# Altium project ComboCamera_MT9.PrjPcb (part 1 of 2)
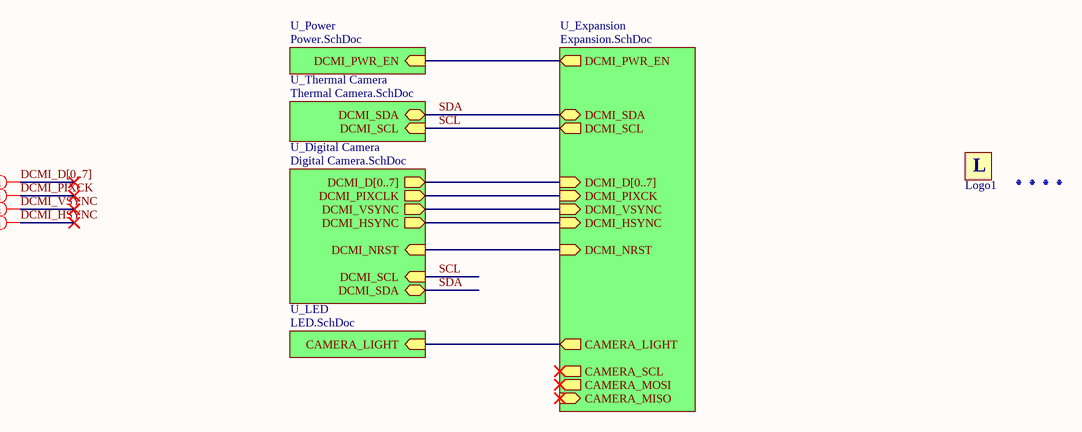
[diagram p0: ComboCamera_MT9.SchDoc]
6 sheets, 82 parts. Net scope: hierarchical (ports join the sheet entries above them; power ports are global).
Board file: ComboCamera_MT9.PcbDoc
Sheets:
  ComboCamera_MT9.SchDoc
    U_Power = Power.SchDoc
    U_Digital Camera = Digital Camera.SchDoc
    U_Thermal Camera = Thermal Camera.SchDoc
    U_Expansion = Expansion.SchDoc
    U_LED = LED.SchDoc

## Sheet ComboCamera_MT9.SchDoc: Combo Camera
size A4; Revision: 1; SheetNumber: 1; SheetTotal: 1; SheetSize: A4

### Parts
Fid1  Fiducial mark  [Fiducial]  (value not drawn)  (no BOM)
Fid2  Fiducial mark  [Fiducial]  (value not drawn)  (no BOM)
Fid3  Fiducial mark  [Fiducial]  (value not drawn)  (no BOM)
Fid4  Fiducial mark  [Fiducial]  (value not drawn)  (no BOM)
Logo1  Logo symbol  [LOGO_YILDIZIOT]  (value not drawn)  (no BOM)

### Sub-sheets
U_Digital Camera = Digital Camera.SchDoc: DCMI_D[0..7] (out), DCMI_PIXCLK (out), DCMI_VSYNC (out), DCMI_HSYNC (out), DCMI_SCL (in), DCMI_SDA (bidir), DCMI_NRST (in)
U_Expansion = Expansion.SchDoc: DCMI_NRST (in), DCMI_D[0..7] (in), DCMI_PWR_EN (out), DCMI_VSYNC (in), DCMI_HSYNC (in), DCMI_PIXCK (in), DCMI_SDA (bidir), DCMI_SCL (out), CAMERA_SCL (out), CAMERA_MISO (in), CAMERA_MOSI (out), CAMERA_LIGHT (out)
U_LED = LED.SchDoc: CAMERA_LIGHT (in)
U_Power = Power.SchDoc: DCMI_PWR_EN (in)
U_Thermal Camera = Thermal Camera.SchDoc: DCMI_SDA (bidir), DCMI_SCL (in)

### Nets
CAMERA_LIGHT: sheet U_Expansion/CAMERA_LIGHT, sheet U_LED/CAMERA_LIGHT
DCMI_HSYNC: sheet U_Digital Camera/DCMI_HSYNC, sheet U_Expansion/DCMI_HSYNC
DCMI_NRST: sheet U_Digital Camera/DCMI_NRST, sheet U_Expansion/DCMI_NRST
DCMI_PIXCK: sheet U_Digital Camera/DCMI_PIXCLK, sheet U_Expansion/DCMI_PIXCK
DCMI_PWREN: sheet U_Power/DCMI_PWR_EN, sheet U_Expansion/DCMI_PWR_EN
DCMI_VSYNC: sheet U_Digital Camera/DCMI_VSYNC, sheet U_Expansion/DCMI_VSYNC
SCL: sheet U_Digital Camera/DCMI_SCL, sheet U_Thermal Camera/DCMI_SCL, sheet U_Expansion/DCMI_SCL  [project net DCMI_SCL]
SDA: sheet U_Digital Camera/DCMI_SDA, sheet U_Thermal Camera/DCMI_SDA, sheet U_Expansion/DCMI_SDA  [project net DCMI_SDA]

### Buses and harness runs
bus DCMI_D[0..7]
bus sheet U_Digital Camera/DCMI_D[0..7] = sheet U_Expansion/DCMI_D[0..7]

### Layout directives
rule Matched Net Lengths [Tolerance = 100mil]; net class DCMI: (no net found under the mark), DCMI_HSYNC, DCMI_PIXCK, DCMI_VSYNC

### Notes on the sheet
- Title:
- Size:
- Project:
- Revision:
- Sheet
- of
- Date:
- YıLDıZ IoT
- Elperek Mahallesi
- Saray Sokak, No:12
- SAKARYA / TURKEY
- File:
- (in symbol Logo) L

### Library data of the parts
Fid1-Fid4 = Fiducial: Part Number: Fid-Mark; Artikkelnr Noca: N.A.; Manufacturer: *; Manufacturer Part Number: *; Datasheet: *; LatestRevisionDate: 2009-12-12; Pin Count: 1; Publisher: Nordic Semiconductor; Published: 2009-12-12; Value: *; Note: *; Supplier: *; Supplier part number: *; 2nd source Supplier: *; 2nd source part number: *; Footprint Doc: Fiducial; Artikkelnr Simpro: N.A.
Logo1 = Logo: Schematic symbol for Logo

## Sheet Power.SchDoc: POWER
size A4; SheetSize: A4
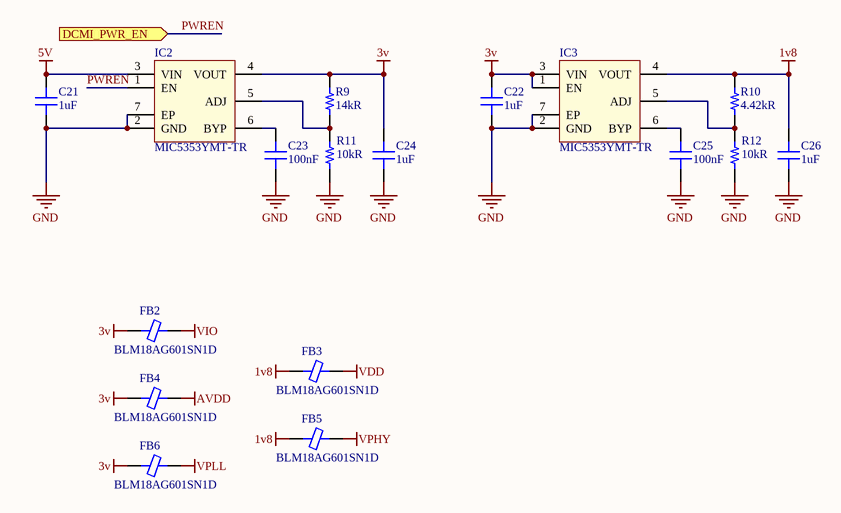
[diagram p1: Power.SchDoc]

### Parts
C21  1uF  [CAP 0603/1608]
C22  1uF  [CAP 0603/1608]
C23  100nF  [CAP 0603/1608]
C24  1uF  [CAP 0603/1608]
C25  100nF  [CAP 0603/1608]
C26  1uF  [CAP 0603/1608]
FB2  BLM18AG601SN1D  [FER 0603/1608]
FB3  BLM18AG601SN1D  [FER 0603/1608]
FB4  BLM18AG601SN1D  [FER 0603/1608]
FB5  BLM18AG601SN1D  [FER 0603/1608]
FB6  BLM18AG601SN1D  [FER 0603/1608]
IC2  MIC5353YMT-TR  [MICREL MLF-6 1.6x1.6MM]
IC3  MIC5353YMT-TR  [MICREL MLF-6 1.6x1.6MM]
R9  14kR  [RES 0603/1608]
R10  4.42kR  [RES 0603/1608]
R11  10kR  [RES 0603/1608]
R12  10kR  [RES 0603/1608]

### Ports
DCMI_PWR_EN (in)

### Nets
1v8: C26.2 FB3.2 FB5.2 IC3.4(VOUT) R10.2
3v: C22.2 C24.2 FB2.2 FB4.2 FB6.2 IC2.4(VOUT) IC3.1(EN) IC3.3(VIN) R9.2
5V: C21.2 IC2.3(VIN)
AVDD: FB4.1
GND: C21.1 C22.1 C23.1 C24.1 C25.1 C26.1 IC2.2(GND) IC2.7(EP) IC3.2(GND) IC3.7(EP) R11.2 R12.2
VDD: FB3.1
VIO: FB2.1
VPHY: FB5.1
VPLL: FB6.1
PWREN: IC2.1(EN) ; port DCMI_PWR_EN  [project net DCMI_PWREN]
NetC23_2: C23.2 IC2.6(BYP)
NetC25_2: C25.2 IC3.6(BYP)
NetIC2_5: IC2.5(ADJ) R9.1 R11.1
NetIC3_5: IC3.5(ADJ) R10.1 R12.1

### Notes on the sheet
- Title:
- Size:
- Project:
- Revision:
- Sheet
- of
- Date:
- YıLDıZ IoT
- Elperek Mahallesi
- Saray Sokak, No:12
- SAKARYA / TURKEY
- File:

### Library data of the parts
C21 C22 C24 C26 = Capacitor - Ceramic: Ceramic, SMT Capacitor; Manufacturer: Samsung; Manufacturer Part Number: CL10A105KP8NNNC; Tolerance: 10%; Voltage Rating: 10V; Dielectric: X5R; Supplier 1: Digi-Key; Supplier Part Number 1: 1276-1182-1-ND; Stock 1: 4590831; Pricing 1: 1 = 0,10000, 10 = 0,03800, 100 = 0,01680, 500 = 0,01200, 1000 = 0,00943 (USD); RoHS: Yes; Mount: Surface Mount; Case/Package: 0603; Case Code (Metric): 1608; Case Code (Imperial): 0603; Contact Plating: Tin; Min Operating Temperature: -55°C; Max Operating Temperature: 85°C; Packaging: Tape and Reel; Package Quantity: 1; Capacitance: 1uF; Voltage: 10V; Length: 1.6mm; Height: 0.8mm; Width: 0.031inch; Thickness: 0.035inch; Depth: 0.8mm; Radiation Hardening: No; ComponentLink1URL: https://datasheet.ciiva.com/15195/getdatasheetpartid-358616-15195708.pdf?src-supplier=Verical; ComponentLink1Description: https://datasheet.ciiva.com/15195/getdatasheetpartid-358616-15195708.pdf?src-supplier=Verical; ComponentLink2URL: https://datasheet.ciiva.com/16358/cl05b104kq5nnnc-16358431.pdf?src-supplier=Future+Electronics; ComponentLink2Description: https://datasheet.ciiva.com/16358/cl05b104kq5nnnc-16358431.pdf?src-supplier=Future+Electronics
C23 C25 = Capacitor - Ceramic: Ceramic, SMT Capacitor; Manufacturer: Samsung; Manufacturer Part Number: CL10B104JB8NNNC; Tolerance: 5%; Voltage Rating: 50V; Dielectric: X7R; Supplier 1: Digi-Key; Supplier Part Number 1: 1276-1033-1-ND; Stock 1: 223594; Pricing 1: 1 = 0,10000, 10 = 0,05300, 100 = 0,02350, 500 = 0,01680, 1000 = 0,01320 (USD); RoHS: Yes; Mount: Surface Mount; Case/Package: 0603; Case Code (Metric): 1608; Case Code (Imperial): 0603; Material: Ceramic; Contact Plating: Tin; Min Operating Temperature: -55°C; Max Operating Temperature: 125°C; Packaging: Tape and Reel; Package Quantity: 1; Capacitance: 100nF; Voltage: 50V; Length: 1.6mm; Height: 0.8mm; Width: 0.031inch; Thickness: 0.035inch; Depth: 0.8mm; Radiation Hardening: No; ComponentLink1URL: https://media.digikey.com/pdf/Data%20Sheets/Samsung%20PDFs/CL_Series_MLCC_ds.pdf?src-supplier=Digi-Key; ComponentLink1Description: https://media.digikey.com/pdf/Data%20Sheets/Samsung%20PDFs/CL_Series_MLCC_ds.pdf?src-supplier=Digi-Key; ComponentLink2URL: https://www.verical.com/server-webapp/html/getDatasheet?partID=359321&src-supplier=Verical; ComponentLink2Description: https://www.verical.com/server-webapp/html/getDatasheet?partID=359321&src-supplier=Verical; ComponentLink3URL: http://www1.futureelectronics.com/doc/SAMSUNG/CL10B104JB8NNNC.pdf?src-supplier=Future+Electronics; ComponentLink3Description: http://www1.futureelectronics.com/doc/SAMSUNG/CL10B104JB8NNNC.pdf?src-supplier=Future+Electronics; ComponentLink4URL: https://produktinfo.conrad.com/datenblaetter/450000-474999/456613-da-01-en-VS_KONDENSATOR_0603.pdf?src-supplier=Conrad; ComponentLink4Description: https://produktinfo.conrad.com/datenblaetter/450000-474999/456613-da-01-en-VS_KONDENSATOR_0603.pdf?src-supplier=Conrad
FB2-FB6 = Ferrite Chip: SMT Ferrite Chip; Manufacturer: Murata; Material: Steel; Frequency: 100MHz; Tolerance: 25%; Impedance: 600R; Max Current Rating: 500mA; Number of Lines: 1; DC Resistance (DCR): 380mR; Shielding: Unshielded; Supplier 1: Digi-Key; Supplier Part Number 1: 490-1014-1-ND; Manufacturer Part Number: BLM18AG601SN1D; Stock 1: 1151376; Pricing 1: 1 = 0,10000, 10 = 0,07900, 25 = 0,07200, 50 = 0,06480, 100 = 0,04760, 250 = 0,03460, 500 = 0,03170, 1000 = 0,02738 (USD); RoHS: Yes; Case/Package: 0603; Number of Pins: 2; Weight: 7.1E-05oz; Core Material: Ferrite; Case Code (Metric): 1608; Case Code (Imperial): 0603; Min Operating Temperature: -55°C; Max Operating Temperature: 125°C; Package Quantity: 1; Packaging: Tape and Reel; Current Rating: 500mA; Termination: SMD/SMT; Max DC Current: 500mA; Test Frequency: 100MHz; DC Current: 500mA; Military Standard: Not; Number of Circuits: 1; Length: 1.6mm; Height: 0.8mm; Width: 0.8mm; Depth: 0.8mm; Radiation Hardening: No; Lead Free: Lead Free; REACH SVHC: No SVHC; ComponentLink1URL: https://datasheet.ciiva.com/19460/1844766-19460213.pdf?src-supplier=Jameco; ComponentLink1Description: https://datasheet.ciiva.com/19460/1844766-19460213.pdf?src-supplier=Jameco; ComponentLink2URL: https://datasheet.ciiva.com/29347/442309-da-01-en-chip-drossel-0603-600r-500ma-1-6x0-8mm-29347900.pdf?src-supplier=Conrad; ComponentLink2Description: https://datasheet.ciiva.com/29347/442309-da-01-en-chip-drossel-0603-600r-500ma-1-6x0-8mm-29347900.pdf?src-supplier=Conrad; ComponentLink3URL: https://datasheet.ciiva.com/41449/001172228-da-01-en-drossel-0603-600r-1-6x0-8mm-4000st-41449517.pdf?src-supplier=Conrad; ComponentLink3Description: https://datasheet.ciiva.com/41449/001172228-da-01-en-drossel-0603-600r-1-6x0-8mm-4000st-41449517.pdf?src-supplier=Conrad; ComponentLink4URL: https://datasheet.ciiva.com/1012/l0110s0100blm18a-1012018.pdf?src-supplier=Digi-Key; ComponentLink4Description: https://datasheet.ciiva.com/1012/l0110s0100blm18a-1012018.pdf?src-supplier=Digi-Key; ComponentLink5URL: https://datasheet.ciiva.com/1012/l0110s0100blm18a-1012019.pdf?src-supplier=Digi-Key; ComponentLink5Description: https://datasheet.ciiva.com/1012/l0110s0100blm18a-1012019.pdf?src-supplier=Digi-Key; ComponentLink6URL: https://datasheet.ciiva.com/1466/1756147-1466934.pdf?src-supplier=Element14; ComponentLink6Description: https://datasheet.ciiva.com/1466/1756147-1466934.pdf?src-supplier=Element14; ComponentLink7URL: https://datasheet.ciiva.com/3081/l0110s0100blm18a-3081613.pdf?src-supplier=Avnet; ComponentLink7Description: https://datasheet.ciiva.com/3081/l0110s0100blm18a-3081613.pdf?src-supplier=Avnet; ComponentLink8URL: https://datasheet.ciiva.com/1012/l0110s0100blm18a-1012017.pdf?src-supplier=Digi-Key; ComponentLink8Description: https://datasheet.ciiva.com/1012/l0110s0100blm18a-1012017.pdf?src-supplier=Digi-Key; ComponentLink9URL: https://datasheet.ciiva.com/1466/1756147-1466933.pdf?src-supplier=Element14; ComponentLink9Description: https://datasheet.ciiva.com/1466/1756147-1466933.pdf?src-supplier=Element14; ComponentLink10URL: https://datasheet.ciiva.com/16210/l0110s0100blm18a-16210006.pdf?src-supplier=Future+Electronics; ComponentLink10Description: https://datasheet.ciiva.com/16210/l0110s0100blm18a-16210006.pdf?src-supplier=Future+Electronics
IC2 IC3 = MICROCHIP MIC5353: Integrated Circuit; ComponentLink1URL: http://www.farnell.com/datasheets/2245202.pdf?src-supplier=Farnell; ComponentLink1Description: http://www.farnell.com/datasheets/2245202.pdf?src-supplier=Farnell; ComponentLink2URL: http://www.microchip.com/mymicrochip/filehandler.aspx?ddocname=en579989&src-supplier=Digi-Key; ComponentLink2Description: http://www.microchip.com/mymicrochip/filehandler.aspx?ddocname=en579989&src-supplier=Digi-Key; ComponentLink3URL: http://www.farnell.com/datasheets/1692673.pdf?src-supplier=Element14; ComponentLink3Description: http://www.farnell.com/datasheets/1692673.pdf?src-supplier=Element14; Supplier 1: Digi-Key; Supplier Part Number 1: 576-3681-1-ND; Manufacturer: Microchip; Manufacturer Part Number: MIC5353YMT-TR; Stock 1: 1004; Pricing 1: 1 = 0,34000, 25 = 0,28000, 100 = 0,26000 (USD); RoHS: Yes; ComponentLink4URL: https://datasheet.ciiva.com/2049/mic5353-2049344.pdf?src-supplier=Digi-Key; ComponentLink4Description: https://datasheet.ciiva.com/2049/mic5353-2049344.pdf?src-supplier=Digi-Key; ComponentLink5URL: https://datasheet.ciiva.com/2049/mic5353-2049342.pdf?src-supplier=Digi-Key; ComponentLink5Description: https://datasheet.ciiva.com/2049/mic5353-2049342.pdf?src-supplier=Digi-Key; ComponentLink6URL: https://datasheet.ciiva.com/2049/mic5353-2049343.pdf?src-supplier=Digi-Key; ComponentLink6Description: https://datasheet.ciiva.com/2049/mic5353-2049343.pdf?src-supplier=Digi-Key
R9 = Resistor_Chip: Ceramic, SMT Capacitor; Manufacturer: Yageo; Manufacturer Part Number: RC0603FR-0714KL; Tolerance: 1%; Power Rating: 100mW; Voltage Rating: 75V; Temperature Coefficient: 100ppm/°C; Voltage Rating (DC): 50V; Supplier 1: Digi-Key; Supplier Part Number 1: 311-14.0KHRCT-ND; Stock 1: 622097; Pricing 1: 1 = 0,10000, 10 = 0,02300, 100 = 0,00940, 1000 = 0,00421, 2500 = 0,00366 (USD); RoHS: Yes; Case/Package: 0603; Weight: 7.1E-05oz; Case Code (Metric): 1608; Case Code (Imperial): 0603; Min Operating Temperature: -55°C; Max Operating Temperature: 155°C; Resistance: 14kR; Packaging: Tape and Reel; Package Quantity: 1; Max Power Dissipation: 100mW; Features: Moisture Resistant; Composition: Thick Film; Number of Terminations: 2; Termination: SMD/SMT; Military Standard: Not; Length: 1.6mm; Height: 0.022inch; Width: 0.031inch; Depth: 0.8mm; Lead Free: Lead Free; ComponentLink1URL: https://datasheet.ciiva.com/15189/getdatasheetpartid-325152-15189610.pdf?src-supplier=Verical; ComponentLink1Description: https://datasheet.ciiva.com/15189/getdatasheetpartid-325152-15189610.pdf?src-supplier=Verical; ComponentLink2URL: https://datasheet.ciiva.com/2455/pyu-r-int-thick-7-2455089.pdf?src-supplier=Digi-Key; ComponentLink2Description: https://datasheet.ciiva.com/2455/pyu-r-int-thick-7-2455089.pdf?src-supplier=Digi-Key; ComponentLink3URL: https://datasheet.ciiva.com/2455/pyu-r-int-thick-7-2455090.pdf?src-supplier=Digi-Key; ComponentLink3Description: https://datasheet.ciiva.com/2455/pyu-r-int-thick-7-2455090.pdf?src-supplier=Digi-Key; ComponentLink4URL: https://datasheet.ciiva.com/2455/pyu-r-int-thick-7-2455091.pdf?src-supplier=Digi-Key; ComponentLink4Description: https://datasheet.ciiva.com/2455/pyu-r-int-thick-7-2455091.pdf?src-supplier=Digi-Key
R10 = Resistor_Chip: Ceramic, SMT Capacitor; Manufacturer: Yageo; Manufacturer Part Number: RC0603FR-074K42L; Temperature Coefficient: 100ppm/°C; Max Power Dissipation: 100mW; Voltage Rating (DC): 50V; Tolerance: 1%; Voltage Rating: 75V; ComponentLink1URL: https://datasheet.ciiva.com/15189/getdatasheetpartid-325152-15189610.pdf?src-supplier=Verical; ComponentLink1Description: https://datasheet.ciiva.com/15189/getdatasheetpartid-325152-15189610.pdf?src-supplier=Verical; ComponentLink2URL: https://datasheet.ciiva.com/2455/pyu-r-int-thick-7-2455089.pdf?src-supplier=Digi-Key; ComponentLink2Description: https://datasheet.ciiva.com/2455/pyu-r-int-thick-7-2455089.pdf?src-supplier=Digi-Key; ComponentLink3URL: https://datasheet.ciiva.com/2455/pyu-r-int-thick-7-2455090.pdf?src-supplier=Digi-Key; ComponentLink3Description: https://datasheet.ciiva.com/2455/pyu-r-int-thick-7-2455090.pdf?src-supplier=Digi-Key; ComponentLink4URL: https://datasheet.ciiva.com/2455/pyu-r-int-thick-7-2455091.pdf?src-supplier=Digi-Key; ComponentLink4Description: https://datasheet.ciiva.com/2455/pyu-r-int-thick-7-2455091.pdf?src-supplier=Digi-Key; Supplier 1: Digi-Key; Supplier Part Number 1: 311-4.42KHRCT-ND; Stock 1: 131368; Pricing 1: 1 = 0,10000, 10 = 0,02300, 100 = 0,00940, 1000 = 0,00421, 2500 = 0,00366 (USD); RoHS: Yes; Case/Package: 0603; Weight: 7.1E-05oz; Case Code (Imperial): 0603; Case Code (Metric): 1608; Min Operating Temperature: -55°C; Max Operating Temperature: 155°C; Features: Moisture Resistant; Termination: SMD/SMT; Composition: Thick Film; Number of Terminations: 2; Military Standard: Not; Resistance: 4.42kR; Packaging: Tape and Reel; Power Rating: 100mW; Package Quantity: 1; Length: 1.6mm; Height: 0.022inch; Depth: 0.8mm; Width: 0.8mm; Lead Free: Lead Free; ComponentLink5URL: https://datasheet.ciiva.com/2455/pyu-r-int-thick-7-2455035.pdf?src-supplier=Digi-Key; ComponentLink5Description: https://datasheet.ciiva.com/2455/pyu-r-int-thick-7-2455035.pdf?src-supplier=Digi-Key; ComponentLink6URL: https://datasheet.ciiva.com/2455/pyu-r-int-thick-7-2455036.pdf?src-supplier=Digi-Key; ComponentLink6Description: https://datasheet.ciiva.com/2455/pyu-r-int-thick-7-2455036.pdf?src-supplier=Digi-Key; ComponentLink7URL: https://datasheet.ciiva.com/2455/pyu-r-int-thick-7-2455037.pdf?src-supplier=Digi-Key; ComponentLink7Description: https://datasheet.ciiva.com/2455/pyu-r-int-thick-7-2455037.pdf?src-supplier=Digi-Key; ComponentLink8URL: https://datasheet.ciiva.com/15189/getdatasheetpartid-406810-15189757.pdf?src-supplier=Verical; ComponentLink8Description: https://datasheet.ciiva.com/15189/getdatasheetpartid-406810-15189757.pdf?src-supplier=Verical
R11 R12 = Resistor_Chip: Ceramic, SMT Capacitor; Manufacturer: Stackpole Electronics; Manufacturer Part Number: RNCP0603FTD10K0; Tolerance: 1%; Max Power Dissipation: 125mW; Temperature Coefficient: 100ppm/°C; Supplier 1: Digi-Key; Supplier Part Number 1: RNCP0603FTD10K0CT-ND; Stock 1: 183083; Pricing 1: 1 = 0,10000, 10 = 0,06700, 100 = 0,02730, 1000 = 0,01224, 2500 = 0,01063 (USD); RoHS: Yes; Mount: Surface Mount; Case/Package: 0603; Case Code (Metric): 1608; Case Code (Imperial): 0603; Contact Plating: Matte,Tin; Min Operating Temperature: -55°C; Max Operating Temperature: 155°C; Packaging: Tape and Reel; Resistance: 10kR; Composition: Thin Film; Number of Terminations: 2; Features: Anti-Sulfur,Moisture Resistant; Length: 0.059inch; Height: 0.02inch; Width: 0.031inch; Radiation Hardening: No; Lead Free: Lead Free

## Sheet Digital Camera.SchDoc
size A4; SheetSize: A4 P
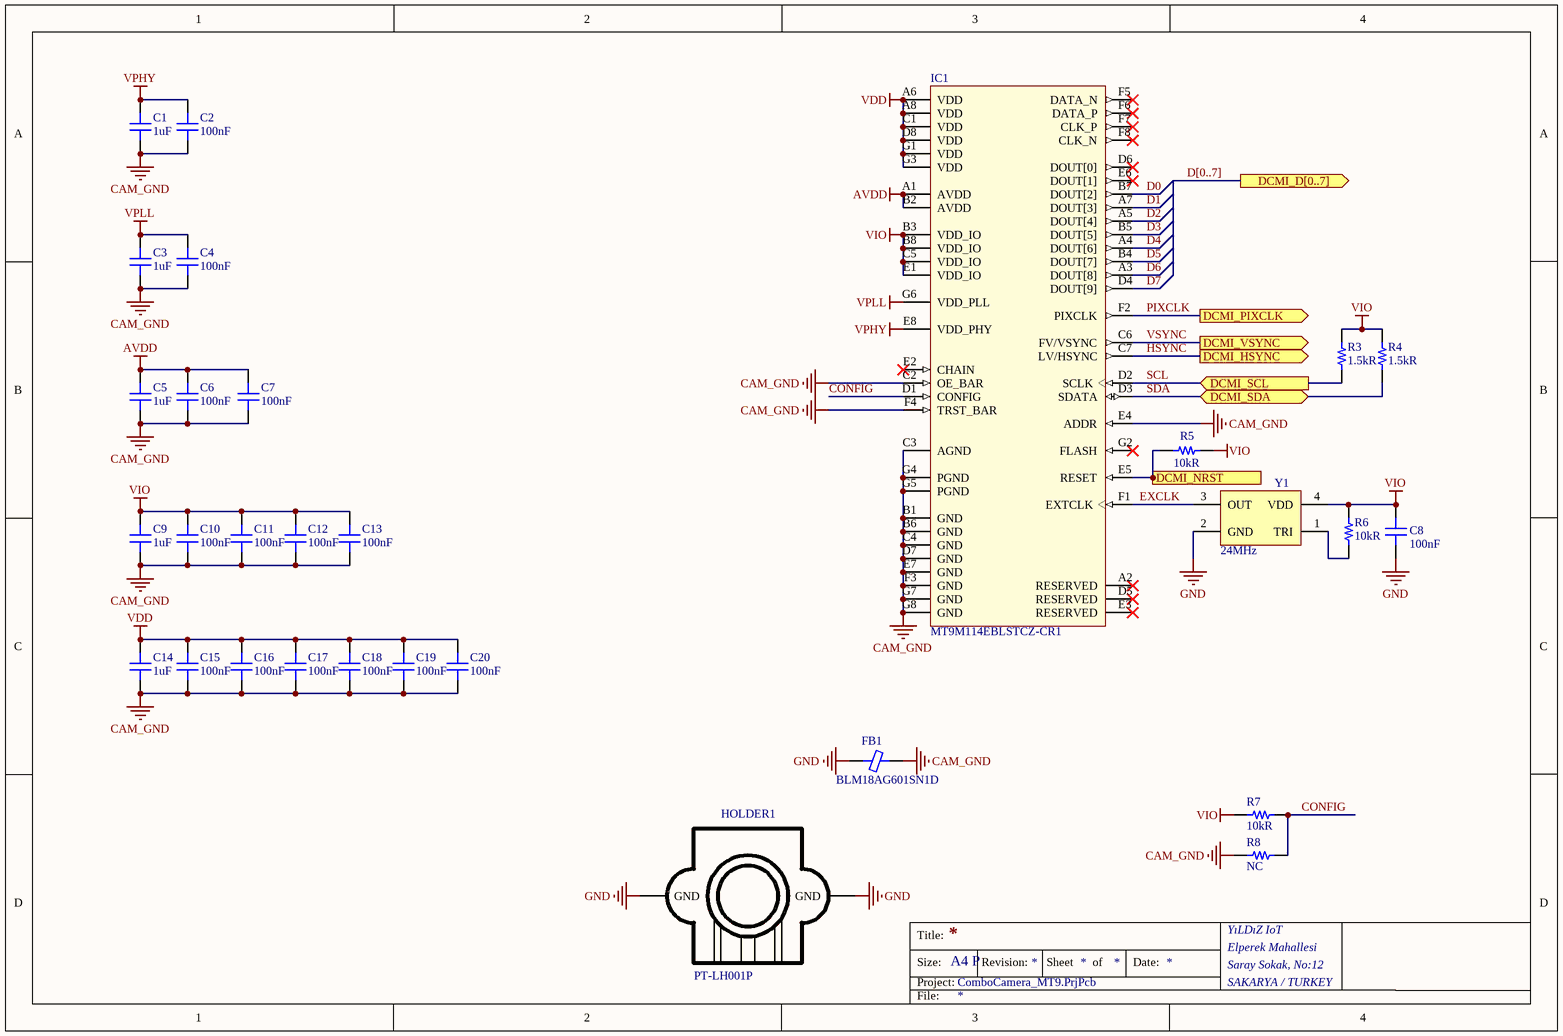
[diagram p2: Digital Camera.SchDoc]

### Parts
C1  1uF  [CAP 0603/1608]
C2  100nF  [CAP 0603/1608]
C3  1uF  [CAP 0603/1608]
C4  100nF  [CAP 0603/1608]
C5  1uF  [CAP 0603/1608]
C6  100nF  [CAP 0603/1608]
C7  100nF  [CAP 0603/1608]
C8  100nF  [CAP 0603/1608]
C9  1uF  [CAP 0603/1608]
C10  100nF  [CAP 0603/1608]
C11  100nF  [CAP 0603/1608]
C12  100nF  [CAP 0603/1608]
C13  100nF  [CAP 0603/1608]
C14  1uF  [CAP 0603/1608]
C15  100nF  [CAP 0603/1608]
C16  100nF  [CAP 0603/1608]
C17  100nF  [CAP 0603/1608]
C18  100nF  [CAP 0603/1608]
C19  100nF  [CAP 0603/1608]
C20  100nF  [CAP 0603/1608]
FB1  BLM18AG601SN1D  [FER 0603/1608]
HOLDER1  PT-LH001P  [M12 LENS HOLDER]
IC1  MT9M114EBLSTCZ-CR1  [ON SEMI MT9M114 BGA-55]
R3  1.5kR  [RES 0603/1608]
R4  1.5kR  [RES 0603/1608]
R5  10kR  [RES 0603/1608]
R6  10kR  [RES 0603/1608]
R7  10kR  [RES 0603/1608]
R8  10kR  [RES 0603/1608]  (value not drawn)  (no BOM)
Y1  24MHz  [Abracon ASTX-11]

### Ports
DCMI_D[0..7] (out), DCMI_HSYNC (out), DCMI_NRST (in), DCMI_PIXCLK (out), DCMI_SCL (in), DCMI_SDA (bidir), DCMI_VSYNC (out)

### Nets
AVDD: C5.2 C6.2 C7.2 IC1.A1(AVDD) IC1.B2(AVDD)
CAM_GND: C1.1 C2.1 C3.1 C4.1 C5.1 C6.1 C7.1 C9.1 C10.1 C11.1 C12.1 C13.1 C14.1 C15.1 C16.1 C17.1 C18.1 C19.1 C20.1 FB1.1 IC1.B1(GND) IC1.B6(GND) IC1.C2(OE_BAR) IC1.C3(AGND) IC1.C4(GND) IC1.D7(GND) IC1.E4(ADDR) IC1.E7(GND) IC1.F3(GND) IC1.F4(TRST_BAR) IC1.G4(PGND) IC1.G5(PGND) IC1.G7(GND) IC1.G8(GND) R8.1
GND: C8.1 FB1.2 HOLDER1.GND Y1.2(GND)
VDD: C14.2 C15.2 C16.2 C17.2 C18.2 C19.2 C20.2 IC1.A6(VDD) IC1.A8(VDD) IC1.C1(VDD) IC1.D8(VDD) IC1.G1(VDD) IC1.G3(VDD)
VIO: C8.2 C9.2 C10.2 C11.2 C12.2 C13.2 IC1.B3(VDD_IO) IC1.B8(VDD_IO) IC1.C5(VDD_IO) IC1.E1(VDD_IO) R3.2 R4.2 R5.1 R6.1 R7.1 Y1.4(VDD)
VPHY: C1.2 C2.2 IC1.E8(VDD_PHY)
VPLL: C3.2 C4.2 IC1.G6(VDD_PLL)
CONFIG: IC1.D1(CONFIG) R7.2 R8.2
D0: IC1.B7(DOUT[2])
D1: IC1.A7(DOUT[3])
D2: IC1.A5(DOUT[4])
D3: IC1.B5(DOUT[5])
D4: IC1.A4(DOUT[6])
D5: IC1.B4(DOUT[7])
D6: IC1.A3(DOUT[8])
D7: IC1.D4(DOUT[9])
DCMI_NRST: IC1.E5(RESET) R5.2 ; port DCMI_NRST
EXCLK: IC1.F1(EXTCLK) Y1.3(OUT)
HSYNC: IC1.C7(LV/HSYNC) ; port DCMI_HSYNC  [project net DCMI_HSYNC]
PIXCLK: IC1.F2(PIXCLK) ; port DCMI_PIXCLK  [project net DCMI_PIXCK]
SCL: IC1.D2(SCLK) R3.1 ; port DCMI_SCL  [project net DCMI_SCL]
SDA: IC1.D3(SDATA) R4.1 ; port DCMI_SDA  [project net DCMI_SDA]
VSYNC: IC1.C6(FV/VSYNC) ; port DCMI_VSYNC  [project net DCMI_VSYNC]
NetR6_2: R6.2 Y1.1(TRI)

Not connected (* = marked no-connect by the designer): IC1 A2(RESERVED)* D5(RESERVED)* D6(DOUT[0])* E2(CHAIN)* E3(RESERVED)* E6(DOUT[1])* F5(DATA_N)* F6(DATA_P)* F7(CLK_P)* F8(CLK_N)* G2(FLASH)*

### Buses and harness runs
bus D[0..7] = port DCMI_D[0..7]

### Notes on the sheet
- Title:
- Size:
- Project:
- Revision:
- Sheet
- of
- Date:
- YıLDıZ IoT
- Elperek Mahallesi
- Saray Sokak, No:12
- SAKARYA / TURKEY
- File:

### Library data of the parts
C1 C3 C5 C9 C14 = Capacitor - Ceramic: as C21 on sheet Power; Supplier 1: Digi-Key; Supplier Part Number 1: 1276-1182-1-ND; Stock 1: 4590831; Pricing 1: 1 = 0,10000, 10 = 0,03800, 100 = 0,01680, 500 = 0,01200, 1000 = 0,00943 (USD); RoHS: Yes; Mount: Surface Mount; Case/Package: 0603; Case Code (Metric): 1608; Case Code (Imperial): 0603; Contact Plating: Tin; Min Operating Temperature: -55°C; Max Operating Temperature: 85°C; Packaging: Tape and Reel; Package Quantity: 1; Capacitance: 1uF; Voltage: 10V; Length: 1.6mm; Height: 0.8mm; Width: 0.031inch; Thickness: 0.035inch; Depth: 0.8mm; Radiation Hardening: No; ComponentLink1URL: https://datasheet.ciiva.com/15195/getdatasheetpartid-358616-15195708.pdf?src-supplier=Verical; ComponentLink1Description: https://datasheet.ciiva.com/15195/getdatasheetpartid-358616-15195708.pdf?src-supplier=Verical; ComponentLink2URL: https://datasheet.ciiva.com/16358/cl05b104kq5nnnc-16358431.pdf?src-supplier=Future+Electronics; ComponentLink2Description: https://datasheet.ciiva.com/16358/cl05b104kq5nnnc-16358431.pdf?src-supplier=Future+Electronics
C2 C4 C6-C8 C10-C13 C15-C20 = Capacitor - Ceramic: as C23 on sheet Power; Supplier 1: Digi-Key; Supplier Part Number 1: 1276-1033-1-ND; Stock 1: 223594; Pricing 1: 1 = 0,10000, 10 = 0,05300, 100 = 0,02350, 500 = 0,01680, 1000 = 0,01320 (USD); RoHS: Yes; Mount: Surface Mount; Case/Package: 0603; Case Code (Metric): 1608; Case Code (Imperial): 0603; Material: Ceramic; Contact Plating: Tin; Min Operating Temperature: -55°C; Max Operating Temperature: 125°C; Packaging: Tape and Reel; Package Quantity: 1; Capacitance: 100nF; Voltage: 50V; Length: 1.6mm; Height: 0.8mm; Width: 0.031inch; Thickness: 0.035inch; Depth: 0.8mm; Radiation Hardening: No; ComponentLink1URL: https://media.digikey.com/pdf/Data%20Sheets/Samsung%20PDFs/CL_Series_MLCC_ds.pdf?src-supplier=Digi-Key; ComponentLink1Description: https://media.digikey.com/pdf/Data%20Sheets/Samsung%20PDFs/CL_Series_MLCC_ds.pdf?src-supplier=Digi-Key; ComponentLink2URL: https://www.verical.com/server-webapp/html/getDatasheet?partID=359321&src-supplier=Verical; ComponentLink2Description: https://www.verical.com/server-webapp/html/getDatasheet?partID=359321&src-supplier=Verical; ComponentLink3URL: http://www1.futureelectronics.com/doc/SAMSUNG/CL10B104JB8NNNC.pdf?src-supplier=Future+Electronics; ComponentLink3Description: http://www1.futureelectronics.com/doc/SAMSUNG/CL10B104JB8NNNC.pdf?src-supplier=Future+Electronics; ComponentLink4URL: https://produktinfo.conrad.com/datenblaetter/450000-474999/456613-da-01-en-VS_KONDENSATOR_0603.pdf?src-supplier=Conrad; ComponentLink4Description: https://produktinfo.conrad.com/datenblaetter/450000-474999/456613-da-01-en-VS_KONDENSATOR_0603.pdf?src-supplier=Conrad
FB1 = Ferrite Chip: as FB2 on sheet Power; Supplier 1: Digi-Key; Supplier Part Number 1: 490-1014-1-ND; Manufacturer Part Number: BLM18AG601SN1D; Stock 1: 1151376; Pricing 1: 1 = 0,10000, 10 = 0,07900, 25 = 0,07200, 50 = 0,06480, 100 = 0,04760, 250 = 0,03460, 500 = 0,03170, 1000 = 0,02738 (USD); RoHS: Yes; Case/Package: 0603; Number of Pins: 2; Weight: 7.1E-05oz; Core Material: Ferrite; Case Code (Metric): 1608; Case Code (Imperial): 0603; Min Operating Temperature: -55°C; Max Operating Temperature: 125°C; Package Quantity: 1; Packaging: Tape and Reel; Current Rating: 500mA; Termination: SMD/SMT; Max DC Current: 500mA; Test Frequency: 100MHz; DC Current: 500mA; Military Standard: Not; Number of Circuits: 1; Length: 1.6mm; Height: 0.8mm; Width: 0.8mm; Depth: 0.8mm; Radiation Hardening: No; Lead Free: Lead Free; REACH SVHC: No SVHC; ComponentLink1URL: https://datasheet.ciiva.com/19460/1844766-19460213.pdf?src-supplier=Jameco; ComponentLink1Description: https://datasheet.ciiva.com/19460/1844766-19460213.pdf?src-supplier=Jameco; ComponentLink2URL: https://datasheet.ciiva.com/29347/442309-da-01-en-chip-drossel-0603-600r-500ma-1-6x0-8mm-29347900.pdf?src-supplier=Conrad; ComponentLink2Description: https://datasheet.ciiva.com/29347/442309-da-01-en-chip-drossel-0603-600r-500ma-1-6x0-8mm-29347900.pdf?src-supplier=Conrad; ComponentLink3URL: https://datasheet.ciiva.com/41449/001172228-da-01-en-drossel-0603-600r-1-6x0-8mm-4000st-41449517.pdf?src-supplier=Conrad; ComponentLink3Description: https://datasheet.ciiva.com/41449/001172228-da-01-en-drossel-0603-600r-1-6x0-8mm-4000st-41449517.pdf?src-supplier=Conrad; ComponentLink4URL: https://datasheet.ciiva.com/1012/l0110s0100blm18a-1012018.pdf?src-supplier=Digi-Key; ComponentLink4Description: https://datasheet.ciiva.com/1012/l0110s0100blm18a-1012018.pdf?src-supplier=Digi-Key; ComponentLink5URL: https://datasheet.ciiva.com/1012/l0110s0100blm18a-1012019.pdf?src-supplier=Digi-Key; ComponentLink5Description: https://datasheet.ciiva.com/1012/l0110s0100blm18a-1012019.pdf?src-supplier=Digi-Key; ComponentLink6URL: https://datasheet.ciiva.com/1466/1756147-1466934.pdf?src-supplier=Element14; ComponentLink6Description: https://datasheet.ciiva.com/1466/1756147-1466934.pdf?src-supplier=Element14; ComponentLink7URL: https://datasheet.ciiva.com/3081/l0110s0100blm18a-3081613.pdf?src-supplier=Avnet; ComponentLink7Description: https://datasheet.ciiva.com/3081/l0110s0100blm18a-3081613.pdf?src-supplier=Avnet; ComponentLink8URL: https://datasheet.ciiva.com/1012/l0110s0100blm18a-1012017.pdf?src-supplier=Digi-Key; ComponentLink8Description: https://datasheet.ciiva.com/1012/l0110s0100blm18a-1012017.pdf?src-supplier=Digi-Key; ComponentLink9URL: https://datasheet.ciiva.com/1466/1756147-1466933.pdf?src-supplier=Element14; ComponentLink9Description: https://datasheet.ciiva.com/1466/1756147-1466933.pdf?src-supplier=Element14; ComponentLink10URL: https://datasheet.ciiva.com/16210/l0110s0100blm18a-16210006.pdf?src-supplier=Future+Electronics; ComponentLink10Description: https://datasheet.ciiva.com/16210/l0110s0100blm18a-16210006.pdf?src-supplier=Future+Electronics
HOLDER1 = LENS HOLDER: Pricing 1: 1 = 3,00 (USD); Supplier: m12lenses; Supplier Link: http://www.m12lenses.com/M12-Lens-Holder-Plastic-p/pt-lh001p.htm; Supplier Part Number: PT-LH001P; Manufacturer Part Number: PT-LH001P; Manufacturer: *
IC1 = ON SEMI MT9M114: 1/6‐inch 720p High‐Definition (HD) System‐On‐a‐Chip (SOC) Digital Image Sensor; Manufacturer: ON Semiconductor; Supplier 1: Digi-Key; Supplier Part Number 1: MT9M114EBLSTCZ-CR1-ND; Manufacturer Part Number: MT9M114EBLSTCZ-CR1; Stock 1: 425; Pricing 1: 1 = 7,38000, 5 = 6,47200, 10 = 5,82500, 25 = 5,17800, 50 = 4,78960, 100 = 4,14240, 500 = 3,88350, 1000 = 3,62460 (USD); RoHS: No; Lead Free: Lead Free
R3 R4 = Resistor_Chip: Ceramic, SMT Capacitor; Manufacturer: Yageo; Manufacturer Part Number: RC0603FR-071K5L; Tolerance: 1%; Voltage Rating (DC): 50V; Temperature Coefficient: 100ppm/°C; Power Rating: 100mW; Supplier 1: Digi-Key; Supplier Part Number 1: 311-1.50KHRCT-ND; Stock 1: 4073514; Pricing 1: 1 = 0,10000, 10 = 0,02300, 100 = 0,00940, 1000 = 0,00421, 2500 = 0,00366 (USD); RoHS: Yes; Case/Package: 0603; Number of Pins: 2; Case Code (Metric): 1608; Case Code (Imperial): 0603; Min Operating Temperature: -55°C; Max Operating Temperature: 155°C; Packaging: Tape and Reel; Resistance: 1.5kR; Composition: Thick Film; Voltage Rating: 50V; Number of Terminations: 2; Termination: SMD/SMT; Military Standard: Not; Package Quantity: 1; Features: Moisture Resistant; Max Power Dissipation: 100mW; Length: 0.063inch; Height: 0.022inch; Width: 0.031inch; Depth: 0.8mm; REACH SVHC: No SVHC; Lead Free: Lead Free; ComponentLink1URL: https://datasheet.ciiva.com/2454/pyu-r-int-thick-7-2454513.pdf?src-supplier=Digi-Key; ComponentLink1Description: https://datasheet.ciiva.com/2454/pyu-r-int-thick-7-2454513.pdf?src-supplier=Digi-Key; ComponentLink2URL: https://datasheet.ciiva.com/2454/pyu-r-int-thick-7-2454514.pdf?src-supplier=Digi-Key; ComponentLink2Description: https://datasheet.ciiva.com/2454/pyu-r-int-thick-7-2454514.pdf?src-supplier=Digi-Key; ComponentLink3URL: https://datasheet.ciiva.com/2454/pyu-r-int-thick-7-2454515.pdf?src-supplier=Digi-Key; ComponentLink3Description: https://datasheet.ciiva.com/2454/pyu-r-int-thick-7-2454515.pdf?src-supplier=Digi-Key; ComponentLink4URL: https://datasheet.ciiva.com/46440/1868787-46440895.pdf?src-supplier=Element14; ComponentLink4Description: https://datasheet.ciiva.com/46440/1868787-46440895.pdf?src-supplier=Element14
R5-R8 = Resistor_Chip: as R11 on sheet Power; Supplier 1: Digi-Key; Supplier Part Number 1: RNCP0603FTD10K0CT-ND; Stock 1: 183083; Pricing 1: 1 = 0,10000, 10 = 0,06700, 100 = 0,02730, 1000 = 0,01224, 2500 = 0,01063 (USD); RoHS: Yes; Mount: Surface Mount; Case/Package: 0603; Case Code (Metric): 1608; Case Code (Imperial): 0603; Contact Plating: Matte,Tin; Min Operating Temperature: -55°C; Max Operating Temperature: 155°C; Packaging: Tape and Reel; Resistance: 10kR; Composition: Thin Film; Number of Terminations: 2; Features: Anti-Sulfur,Moisture Resistant; Length: 0.059inch; Height: 0.02inch; Width: 0.031inch; Radiation Hardening: No; Lead Free: Lead Free
  R8: NC: NC
Y1 = ASD1-1.544MHZ-EC-T: OSC XO 1.544MHZ CMOS SMD; Manufacturer: ECS Inc.; Manufacturer Part Number: ECS-3225MV-240-CN-TR; Base Resonator: Crystal; Function: Enable/Disable; Output: HCMOS; Voltage - Supply: 1.62V ~ 3.63V; Frequency Stability: ±25ppm; ComponentLink1Description: Datasheet; ComponentLink1URL: http://www.abracon.com/Oscillators/ASDseries.pdf; ComponentLink2Description: Digi-Key Listing; ComponentLink2URL: https://www.digikey.com/product-detail/en/ASD1-1.544MHZ-EC-T/535-9579-2-ND/1236896; Supplier 1: Digi-Key; Supplier Part Number 1: XC2884CT-ND; Stock 1: 1655; Pricing 1: 1 = 0,92000, 10 = 0,81700, 50 = 0,76380, 100 = 0,67510, 500 = 0,63954 (USD); RoHS: No; ComponentLink3URL: https://www.ecsxtal.com/store/pdf/ECS-3225MV.pdf?src-supplier=Digi-Key; ComponentLink3Description: https://www.ecsxtal.com/store/pdf/ECS-3225MV.pdf?src-supplier=Digi-Key; Packaging: Cut Tape (CT); Type: XO (Standard); Frequency: 24MHz; Series: ECS-3225MV

## Sheet Thermal Camera.SchDoc: Thermal
size A4; SheetSize: A4
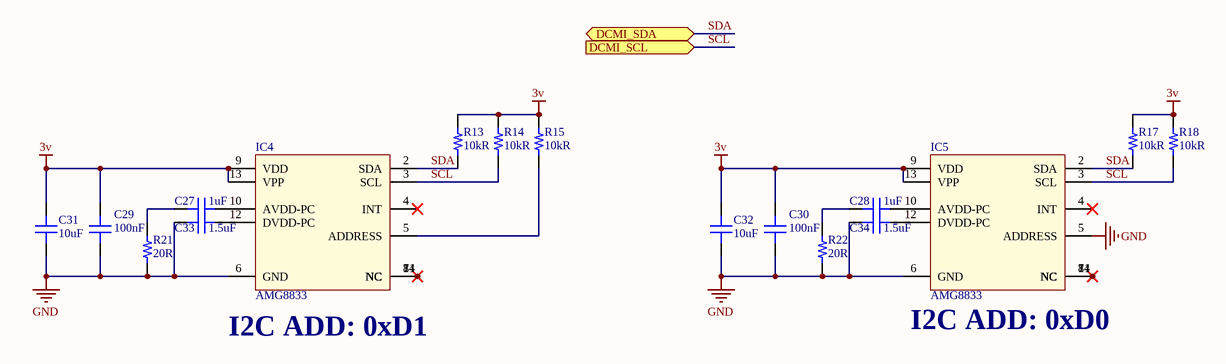
[diagram p3: Thermal Camera.SchDoc]

### Parts
C27  1uF  [CAP 0603/1608]
C28  1uF  [CAP 0603/1608]
C29  100nF  [CAP 0603/1608]
C30  100nF  [CAP 0603/1608]
C31  10uF  [CAP 0603/1608]
C32  10uF  [CAP 0603/1608]
C33  1.5uF  [CAP 0603/1608]
C34  1.5uF  [CAP 0603/1608]
IC4  AMG8833  [PANASONIC AMG8853]
IC5  AMG8833  [PANASONIC AMG8853]
R13  10kR  [RES 0603/1608]
R14  10kR  [RES 0603/1608]
R15  10kR  [RES 0603/1608]
R17  10kR  [RES 0603/1608]
R18  10kR  [RES 0603/1608]
R21  20R  [RES 0603/1608]
R22  20R  [RES 0603/1608]

### Ports
DCMI_SCL (in), DCMI_SDA (bidir)

### Nets
3v: C29.1 C30.1 C31.2 C32.2 IC4.9(VDD) IC4.13(VPP) IC5.9(VDD) IC5.13(VPP) R13.2 R14.2 R15.2 R17.2 R18.2
GND: C29.2 C30.2 C31.1 C32.1 C33.2 C34.2 IC4.6(GND) IC5.5(ADDRESS) IC5.6(GND) R21.1 R22.1
SCL: IC4.3(SCL) IC5.3(SCL) R14.1 R18.1 ; port DCMI_SCL  [project net DCMI_SCL]
SDA: IC4.2(SDA) IC5.2(SDA) R13.1 R17.1 ; port DCMI_SDA  [project net DCMI_SDA]
NetC27_1: C27.1 R21.2
NetC27_2: C27.2 IC4.10(AVDD-PC)
NetC28_1: C28.1 R22.2
NetC28_2: C28.2 IC5.10(AVDD-PC)
NetC33_1: C33.1 IC4.12(DVDD-PC)
NetC34_1: C34.1 IC5.12(DVDD-PC)
NetIC4_1: IC4.1(NC) IC4.7(NC) IC4.8(NC) IC4.11(NC) IC4.14(NC)
NetIC4_5: IC4.5(ADDRESS) R15.1
NetIC5_1: IC5.1(NC) IC5.7(NC) IC5.8(NC) IC5.11(NC) IC5.14(NC)

Not connected (* = marked no-connect by the designer): IC4 4(INT)*; IC5 4(INT)*

### Notes on the sheet
- (near IC4) I2C ADD: 0xD1
- (near IC5) I2C ADD: 0xD0
- Title:
- Size:
- Project:
- Revision:
- Sheet
- of
- Date:
- YıLDıZ IoT
- Elperek Mahallesi
- Saray Sokak, No:12
- SAKARYA / TURKEY
- File:

### Library data of the parts
C27 C28 = Capacitor - Ceramic: as C21 on sheet Power; Supplier 1: Digi-Key; Supplier Part Number 1: 1276-1182-1-ND; Stock 1: 4590831; Pricing 1: 1 = 0,10000, 10 = 0,03800, 100 = 0,01680, 500 = 0,01200, 1000 = 0,00943 (USD); RoHS: Yes; Mount: Surface Mount; Case/Package: 0603; Case Code (Metric): 1608; Case Code (Imperial): 0603; Contact Plating: Tin; Min Operating Temperature: -55°C; Max Operating Temperature: 85°C; Packaging: Tape and Reel; Package Quantity: 1; Capacitance: 1uF; Voltage: 10V; Length: 1.6mm; Height: 0.8mm; Width: 0.031inch; Thickness: 0.035inch; Depth: 0.8mm; Radiation Hardening: No; ComponentLink1URL: https://datasheet.ciiva.com/15195/getdatasheetpartid-358616-15195708.pdf?src-supplier=Verical; ComponentLink1Description: https://datasheet.ciiva.com/15195/getdatasheetpartid-358616-15195708.pdf?src-supplier=Verical; ComponentLink2URL: https://datasheet.ciiva.com/16358/cl05b104kq5nnnc-16358431.pdf?src-supplier=Future+Electronics; ComponentLink2Description: https://datasheet.ciiva.com/16358/cl05b104kq5nnnc-16358431.pdf?src-supplier=Future+Electronics
C29 C30 = Capacitor - Ceramic: as C23 on sheet Power; Supplier 1: Digi-Key; Supplier Part Number 1: 1276-1033-1-ND; Stock 1: 223594; Pricing 1: 1 = 0,10000, 10 = 0,05300, 100 = 0,02350, 500 = 0,01680, 1000 = 0,01320 (USD); RoHS: Yes; Mount: Surface Mount; Case/Package: 0603; Case Code (Metric): 1608; Case Code (Imperial): 0603; Material: Ceramic; Contact Plating: Tin; Min Operating Temperature: -55°C; Max Operating Temperature: 125°C; Packaging: Tape and Reel; Package Quantity: 1; Capacitance: 100nF; Voltage: 50V; Length: 1.6mm; Height: 0.8mm; Width: 0.031inch; Thickness: 0.035inch; Depth: 0.8mm; Radiation Hardening: No; ComponentLink1URL: https://media.digikey.com/pdf/Data%20Sheets/Samsung%20PDFs/CL_Series_MLCC_ds.pdf?src-supplier=Digi-Key; ComponentLink1Description: https://media.digikey.com/pdf/Data%20Sheets/Samsung%20PDFs/CL_Series_MLCC_ds.pdf?src-supplier=Digi-Key; ComponentLink2URL: https://www.verical.com/server-webapp/html/getDatasheet?partID=359321&src-supplier=Verical; ComponentLink2Description: https://www.verical.com/server-webapp/html/getDatasheet?partID=359321&src-supplier=Verical; ComponentLink3URL: http://www1.futureelectronics.com/doc/SAMSUNG/CL10B104JB8NNNC.pdf?src-supplier=Future+Electronics; ComponentLink3Description: http://www1.futureelectronics.com/doc/SAMSUNG/CL10B104JB8NNNC.pdf?src-supplier=Future+Electronics; ComponentLink4URL: https://produktinfo.conrad.com/datenblaetter/450000-474999/456613-da-01-en-VS_KONDENSATOR_0603.pdf?src-supplier=Conrad; ComponentLink4Description: https://produktinfo.conrad.com/datenblaetter/450000-474999/456613-da-01-en-VS_KONDENSATOR_0603.pdf?src-supplier=Conrad
C31 C32 = Capacitor - Ceramic: Ceramic, SMT Capacitor; Manufacturer: Samsung; Manufacturer Part Number: CL10A106MQ8NNNC; Tolerance: 20%; Voltage Rating: 6.3V; Dielectric: X5R; Supplier 1: Digi-Key; Supplier Part Number 1: 1276-1119-1-ND; Stock 1: 4408315; Pricing 1: 1 = 0,15000, 10 = 0,11000, 100 = 0,05150, 500 = 0,03614, 1000 = 0,02992 (USD); RoHS: Yes; Mount: Surface Mount; Case/Package: 0603; Case Code (Metric): 1608; Case Code (Imperial): 0603; Contact Plating: Tin; Min Operating Temperature: -55°C; Max Operating Temperature: 85°C; Package Quantity: 1; Packaging: Tape and Reel; Capacitance: 10uF; Voltage: 6.3V; Length: 1.6mm; Height: 0.8mm; Width: 0.031inch; Thickness: 0.035inch; Depth: 0.8mm; Radiation Hardening: No; ComponentLink1URL: https://datasheet.ciiva.com/25798/cl10a106mq8nnnc-25798320.pdf?src-supplier=Digi-Key; ComponentLink1Description: https://datasheet.ciiva.com/25798/cl10a106mq8nnnc-25798320.pdf?src-supplier=Digi-Key; ComponentLink2URL: https://datasheet.ciiva.com/26838/getdatasheetpartid-357557-26838347.pdf?src-supplier=Verical; ComponentLink2Description: https://datasheet.ciiva.com/26838/getdatasheetpartid-357557-26838347.pdf?src-supplier=Verical; ComponentLink3URL: https://datasheet.ciiva.com/16437/cl05b104kq5nnnc-16437327.pdf?src-supplier=Future+Electronics; ComponentLink3Description: https://datasheet.ciiva.com/16437/cl05b104kq5nnnc-16437327.pdf?src-supplier=Future+Electronics
C33 C34 = Capacitor - Ceramic: Ceramic, SMT Capacitor; Manufacturer: TDK; Manufacturer Part Number: C1608X7S1C155K080AC; Tolerance: 10%; Voltage Rating: 16V; ComponentLink1URL: https://datasheet.ciiva.com/15195/getdatasheetpartid-358616-15195708.pdf?src-supplier=Verical; ComponentLink1Description: https://datasheet.ciiva.com/15195/getdatasheetpartid-358616-15195708.pdf?src-supplier=Verical; ComponentLink2URL: https://datasheet.ciiva.com/16358/cl05b104kq5nnnc-16358431.pdf?src-supplier=Future+Electronics; ComponentLink2Description: https://datasheet.ciiva.com/16358/cl05b104kq5nnnc-16358431.pdf?src-supplier=Future+Electronics; Supplier 1: Digi-Key; Supplier Part Number 1: 445-174769-1-ND; Stock 1: 2796; Pricing 1: 1 = 0,23000, 10 = 0,15900, 100 = 0,09030, 500 = 0,06376, 1000 = 0,05579 (USD); RoHS: No; Mount: Surface Mount; Case/Package: 0603; Case Code (Imperial): 0603; Case Code (Metric): 1608; Min Operating Temperature: -55°C; Max Operating Temperature: 125°C; Packaging: Tape and Reel; Capacitance: 1.5uF; ComponentLink3URL: https://product.tdk.com/info/en/catalog/spec/mlccspec_commercial_general_midvoltage_en.pdf?src-supplier=Digi-Key; ComponentLink3Description: https://product.tdk.com/info/en/catalog/spec/mlccspec_commercial_general_midvoltage_en.pdf?src-supplier=Digi-Key; ComponentLink4URL: https://product.tdk.com/info/en/catalog/datasheets/mlcc_commercial_general_en.pdf?src-supplier=Digi-Key; ComponentLink4Description: https://product.tdk.com/info/en/catalog/datasheets/mlcc_commercial_general_en.pdf?src-supplier=Digi-Key
IC4 IC5 = Panasonic AMG8833: The Panasonic Electric Works' Grid Eye is a thermopile-type infrared sensor with digital communication. Using advanced MEMS technology, the Grid Eye monitors the quantity of infrared rays for 64 pixels of data. This page describes the internal memory structure that can be accessed through an I2C interface.; Sensing Method: Infrared (IR); Supplier 1: Digi-Key; Supplier Part Number 1: P19002CT-ND; Manufacturer: Panasonic; Manufacturer Part Number: AMG8833; Stock 1: 207; Pricing 1: 1 = 32,50000, 5 = 31,02400, 10 = 28,06900, 25 = 25,85280, 50 = 22,89820 (USD); RoHS: Yes; Case/Package: SMD/SMT; Min Operating Temperature: 0°C; Max Operating Temperature: 80°C; Packaging: Tape and Reel; Output Type: I2C; ComponentLink1URL: https://media.digikey.com/pdf/Data%20Sheets/Panasonic%20Sensors%20PDFs/Grid-EYE_AMG88.pdf?src-supplier=Digi-Key; ComponentLink1Description: https://media.digikey.com/pdf/Data%20Sheets/Panasonic%20Sensors%20PDFs/Grid-EYE_AMG88.pdf?src-supplier=Digi-Key; ComponentLink2URL: http://industrial.panasonic.com/cdbs/www-data/pdf/ADI8000/ADI8000C66.pdf?src-supplier=Newark; ComponentLink2Description: http://industrial.panasonic.com/cdbs/www-data/pdf/ADI8000/ADI8000C66.pdf?src-supplier=Newark; ComponentLink3URL: http://industrial.panasonic.com/cdbs/www-data/pdf/ADI8000/ADI8000C66.pdf?src-supplier=Farnell; ComponentLink3Description: http://industrial.panasonic.com/cdbs/www-data/pdf/ADI8000/ADI8000C66.pdf?src-supplier=Farnell
R13-R15 R17 R18 = Resistor_Chip: as R11 on sheet Power; Supplier 1: Digi-Key; Supplier Part Number 1: RNCP0603FTD10K0CT-ND; Stock 1: 183083; Pricing 1: 1 = 0,10000, 10 = 0,06700, 100 = 0,02730, 1000 = 0,01224, 2500 = 0,01063 (USD); RoHS: Yes; Mount: Surface Mount; Case/Package: 0603; Case Code (Metric): 1608; Case Code (Imperial): 0603; Contact Plating: Matte,Tin; Min Operating Temperature: -55°C; Max Operating Temperature: 155°C; Packaging: Tape and Reel; Resistance: 10kR; Composition: Thin Film; Number of Terminations: 2; Features: Anti-Sulfur,Moisture Resistant; Length: 0.059inch; Height: 0.02inch; Width: 0.031inch; Radiation Hardening: No; Lead Free: Lead Free
R21 R22 = Resistor_Chip: Ceramic, SMT Capacitor; Manufacturer: Yageo; Manufacturer Part Number: RC0603JR-0720RL; Voltage Rating (DC): 50V; Temperature Coefficient: 100ppm/°C; Tolerance: 5%; Max Power Dissipation: 100mW; Voltage Rating: 75V; Supplier 1: Digi-Key; Supplier Part Number 1: 311-20GRCT-ND; Stock 1: 99734; Pricing 1: 1 = 0,10000, 10 = 0,01900, 100 = 0,00770, 1000 = 0,00347, 2500 = 0,00301 (USD); RoHS: Yes; Case/Package: 0603; Weight: 7.1E-05oz; Case Code (Imperial): 0603; Case Code (Metric): 1608; Min Operating Temperature: -55°C; Max Operating Temperature: 155°C; Composition: Thick Film; Resistance: 20R; Packaging: Tape and Reel; Termination: SMD/SMT; Number of Terminations: 2; Military Standard: Not; Features: Moisture Resistant; Power Rating: 100mW; Package Quantity: 1; Length: 1.6mm; Height: 0.022inch; Width: 0.8mm; Depth: 0.8mm; Lead Free: Lead Free; REACH SVHC: Unknown; ComponentLink1URL: https://datasheet.ciiva.com/2453/pyu-r-int-thick-7-2453211.pdf?src-supplier=Digi-Key; ComponentLink1Description: https://datasheet.ciiva.com/2453/pyu-r-int-thick-7-2453211.pdf?src-supplier=Digi-Key; ComponentLink2URL: https://datasheet.ciiva.com/2453/pyu-r-int-thick-7-2453212.pdf?src-supplier=Digi-Key; ComponentLink2Description: https://datasheet.ciiva.com/2453/pyu-r-int-thick-7-2453212.pdf?src-supplier=Digi-Key; ComponentLink3URL: https://datasheet.ciiva.com/2453/pyu-r-int-thick-7-2453213.pdf?src-supplier=Digi-Key; ComponentLink3Description: https://datasheet.ciiva.com/2453/pyu-r-int-thick-7-2453213.pdf?src-supplier=Digi-Key

## Sheet Expansion.SchDoc
size A4; SheetSize: A4
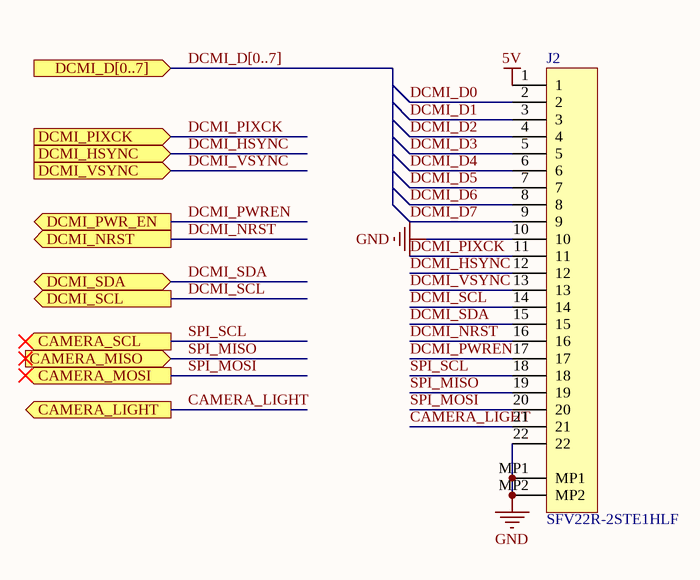
[diagram p4: Expansion.SchDoc]

### Parts
J2  SFV22R-2STE1HLF  [fpc-22]

### Ports
CAMERA_LIGHT (out), CAMERA_MISO (in), CAMERA_MOSI (out), CAMERA_SCL (out), DCMI_D[0..7] (in), DCMI_HSYNC (in), DCMI_NRST (out), DCMI_PIXCK (in), DCMI_PWR_EN (out), DCMI_SCL (out), DCMI_SDA (bidir), DCMI_VSYNC (in)

### Nets
5V: J2.1
GND: J2.10 J2.22 J2.MP1 J2.MP2
CAMERA_LIGHT: J2.21 ; port CAMERA_LIGHT
DCMI_D0: J2.2  [project net D0]
DCMI_D1: J2.3  [project net D1]
DCMI_D2: J2.4  [project net D2]
DCMI_D3: J2.5  [project net D3]
DCMI_D4: J2.6  [project net D4]
DCMI_D5: J2.7  [project net D5]
DCMI_D6: J2.8  [project net D6]
DCMI_D7: J2.9  [project net D7]
DCMI_HSYNC: J2.12 ; port DCMI_HSYNC
DCMI_NRST: J2.16 ; port DCMI_NRST
DCMI_PIXCK: J2.11 ; port DCMI_PIXCK
DCMI_PWREN: J2.17 ; port DCMI_PWR_EN
DCMI_SCL: J2.14 ; port DCMI_SCL
DCMI_SDA: J2.15 ; port DCMI_SDA
DCMI_VSYNC: J2.13 ; port DCMI_VSYNC
SPI_MISO: J2.19 ; port CAMERA_MISO
SPI_MOSI: J2.20 ; port CAMERA_MOSI
SPI_SCL: J2.18 ; port CAMERA_SCL

### Buses and harness runs
bus DCMI_D[0..7] = port DCMI_D[0..7]

### Notes on the sheet
- Title:
- Size:
- Project:
- Revision:
- Sheet
- of
- Date:
- YıLDıZ IoT
- Elperek Mahallesi
- Saray Sokak, No:12
- SAKARYA / TURKEY
- File:

### Library data of the parts
J2 = FPC-22: Connector; Manufacturer: Amphenol FCI; Actuator Material: Glass,Polyphenylene; Current Rating: 500mA; Voltage Rating: 50V; Contact Resistance: 30mR; Number of Positions: 22; Contact Location: Top; Insulation Resistance: 100MR; Wire/Cable Type: Straight; Pitch: 0.5mm; Supplier 1: Digi-Key; Supplier Part Number 1: 609-4319-1-ND; Manufacturer Part Number: SFV22R-2STE1HLF; Stock 1: 2152; Pricing 1: 1 = 0,79000, 10 = 0,74300, 25 = 0,66840, 50 = 0,59420, 100 = 0,56950, 250 = 0,52000, 500 = 0,49522, 1000 = 0,40856 (USD); RoHS: Yes; Mount: Surface Mount; Housing Color: Black; Contact Material: Bronze; Contact Plating: Tin; Housing Material: Polymer; Min Operating Temperature: -55°C; Max Operating Temperature: 105°C; Number of Rows: 1; Package Quantity: 3000; Packaging: Tape and Reel; Max Current Rating: 500mA; Termination: Solder; Number of Contacts: 22; Max Voltage Rating (AC): 50V; Orientation: Right Angle; Length: 16.5mm; Depth: 4.9mm; Radiation Hardening: No; Flammability Rating: UL94 V-0; ComponentLink1URL: https://datasheet.ciiva.com/670/10112793-670003.pdf?src-supplier=Digi-Key; ComponentLink1Description: https://datasheet.ciiva.com/670/10112793-670003.pdf?src-supplier=Digi-Key; ComponentLink2URL: https://datasheet.ciiva.com/670/10112793-670004.pdf?src-supplier=Digi-Key; ComponentLink2Description: https://datasheet.ciiva.com/670/10112793-670004.pdf?src-supplier=Digi-Key; ComponentLink3URL: https://datasheet.ciiva.com/13704/10112793-13704492.pdf?src-supplier=Mouser; ComponentLink3Description: https://datasheet.ciiva.com/13704/10112793-13704492.pdf?src-supplier=Mouser; ComponentLink4URL: https://datasheet.ciiva.com/670/10112793-670005.pdf?src-supplier=Digi-Key; ComponentLink4Description: https://datasheet.ciiva.com/670/10112793-670005.pdf?src-supplier=Digi-Key; ComponentLink5URL: https://datasheet.ciiva.com/10368/10112793-10368190.pdf?src-supplier=Avnet; ComponentLink5Description: https://datasheet.ciiva.com/10368/10112793-10368190.pdf?src-supplier=Avnet